# EAGLE schematic Wk5CADpcb2Schematic (EAGLE 9.7.0)
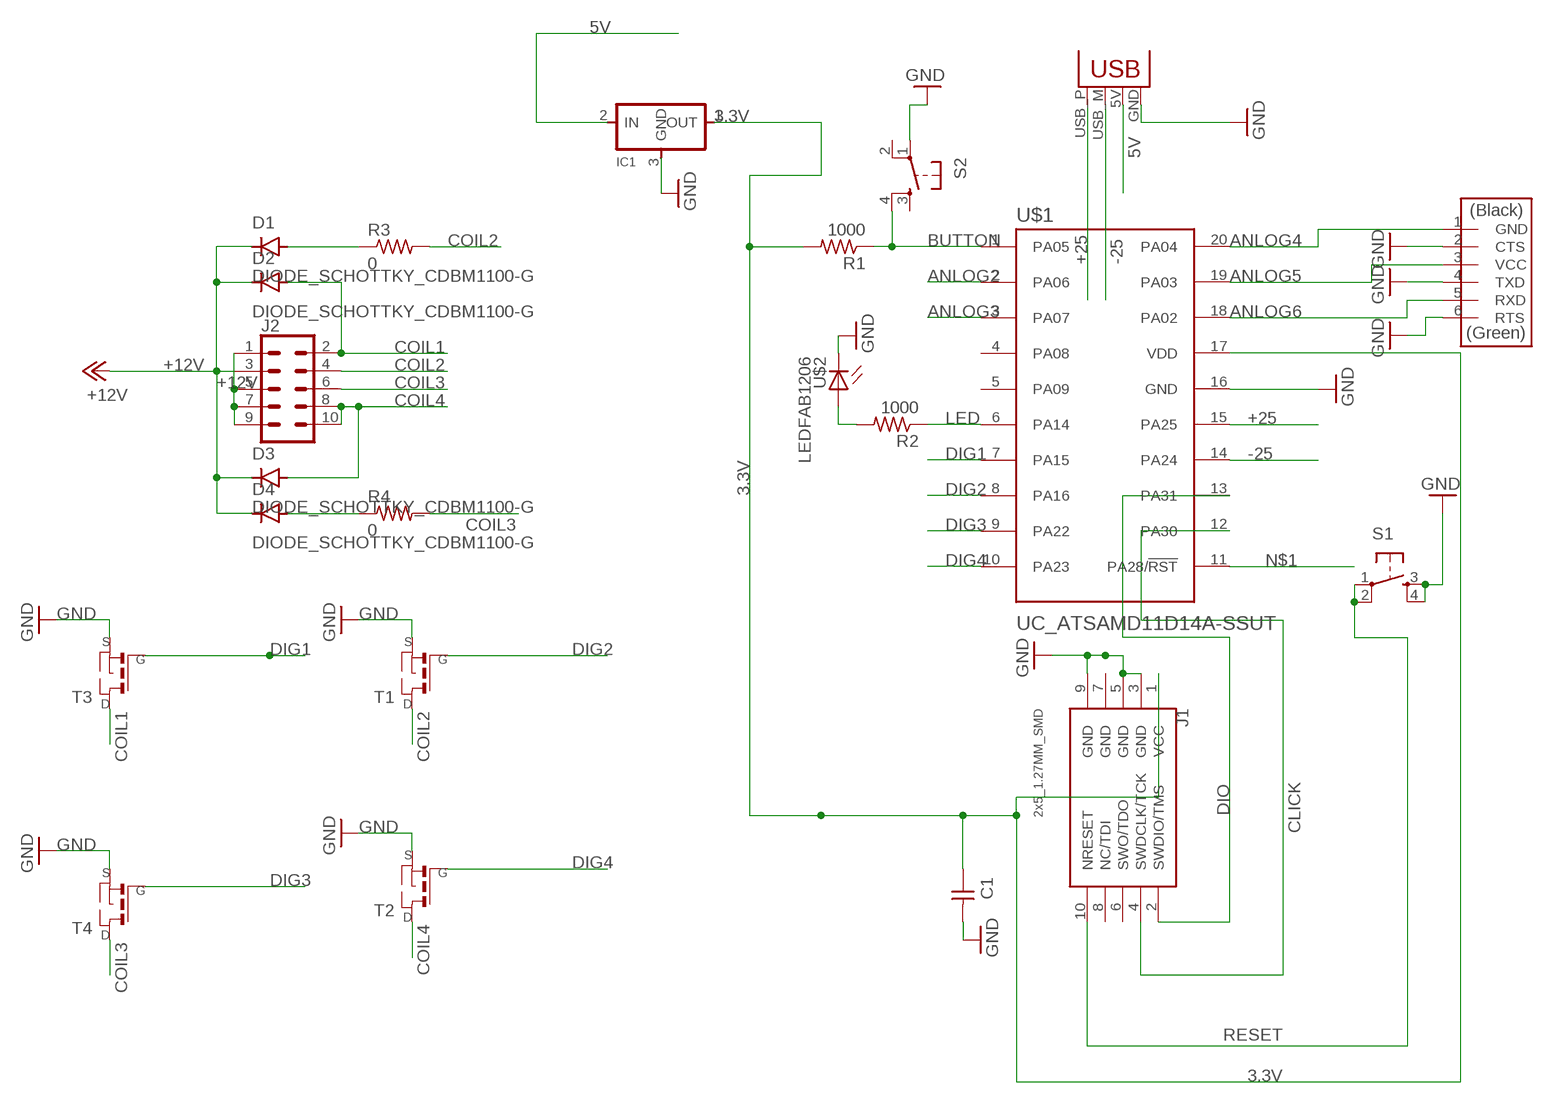
[diagram p0: schematic, sheet 1]

## Parts
C1  CAP_UNPOLARIZEDFAB  [C1206FAB]
D1  DIODE_SCHOTTKY_CDBM1100-G  [MINI-SMA]
D2  DIODE_SCHOTTKY_CDBM1100-G  [MINI-SMA]
D3  DIODE_SCHOTTKY_CDBM1100-G  [MINI-SMA]
D4  DIODE_SCHOTTKY_CDBM1100-G  [MINI-SMA]
IC1  VR_REGULATOR-SOT23SOT23  [SOT23]
J1  CONN_05X2_ARM_DEBUGSMD  [2X5_1.27MM_SMD]
J2  CONN_05X2SHD_SMD  [2X5-SHROUDED_SMD]
R1  1000  R1206FAB  [R1206FAB]
R2  1000  R1206FAB  [R1206FAB]
R3  0  R1206FAB  [R1206FAB]
R4  0  R1206FAB  [R1206FAB]
S1  SW_SWITCH_TACTILE_6MM6MM_SWITCH  [6MM_SWITCH]
S2  SW_SWITCH_TACTILE_6MM6MM_SWITCH  [6MM_SWITCH]
T1  MOSFET_NTO252  [TO252]
T2  MOSFET_NTO252  [TO252]
T3  MOSFET_NTO252  [TO252]
T4  MOSFET_NTO252  [TO252]
U$1  UC_ATSAMD11D14A-SSUT  [SOIC127P1030X265-20N]
U$2  LEDFAB1206  [LED1206FAB]
U$3  CONN_06_FTDI-SMD-HEADER  [1X06SMD]
X1  CONN_USBPCB  [USB-A-PCB]

## Nets
3.3V: C1.1 IC1.1(OUT) J1.1(VCC) R1.2 U$1.17(VDD)
5V: IC1.2(IN) X1.5V(VBUS)
+12V: D1.KATHODE D2.KATHODE D3.KATHODE D4.KATHODE J2.1 J2.3 J2.5 J2.7 J2.9
+25: U$1.15(PA25) X1.USB_P(D+)
-25: U$1.14(PA24) X1.USB_M(D-)
ANLOG2: U$1.2(PA06)
ANLOG3: U$1.3(PA07)
ANLOG4: U$1.20(PA04) U$3.1(GND)
ANLOG5: U$1.19(PA03) U$3.3(VCC)
ANLOG6: U$1.18(PA02) U$3.5(RXD)
BUTTON: R1.1 S2.4(S1) U$1.1(PA05)
CLICK: J1.4(SWDCLK/TCK) U$1.12(PA30)
COIL1: D2.ANODE J2.2 T3.2(D)
COIL2: J2.4 R3.2 T1.2(D)
COIL3: J2.6 R4.2 T4.2(D)
COIL4: D3.ANODE J2.8 J2.10 T2.2(D)
DIG1: T3.1(G) U$1.7(PA15)
DIG2: T1.1(G) U$1.8(PA16)
DIG3: T4.1(G) U$1.9(PA22)
DIG4: T2.1(G) U$1.10(PA23)
DIO: J1.2(SWDIO/TMS) U$1.13(PA31)
GND: C1.2 IC1.3(GND) J1.3(GND) J1.5(GND) J1.9(GND) S1.3(S) S1.4(S1) S2.1(P) T1.3(S) T2.3(S) T3.3(S) T4.3(S) U$1.16(GND) U$2.2(C) U$3.2(CTS) U$3.4(TXD) U$3.6(RTS) X1.GND
LED: R2.1 U$1.6(PA14)
N$1: U$1.11(PA28/!RST)
N$2: R2.2 U$2.1(A)
N$4: D1.ANODE R3.1
N$8: D4.ANODE R4.1
RESET: J1.10(NRESET) S1.1(P) S1.2(P1)
Unconnected: J1.6(SWO/TDO) J1.7(GND) J1.8(NC/TDI) S2.2(P1) S2.3(S) U$1.4(PA08) U$1.5(PA09)

## Library data of the parts
C1 = fab:CAP_UNPOLARIZED
D1-D4 = fab:DIODE_SCHOTTKY_CDBM1100-G: Diode schottky 100V 1A mini-SMA as found in the fablab inventory Reverse Voltage: 100 Volts Forward Current: 1.0 Amp Maximum forward voltage: 0.85 Volts Made by Zaerc.
IC1 = fab:VR_REGULATOR-SOT23
J1 = fab:CONN_05X2_ARM_DEBUG; PACKAGE: 2x5_1.27MM_SMD
J2 = fab:CONN_05X2: Multi connection point. Often used as Generic Header-pin footprint for 0.1 inch spaced/style header connections For AVR SPI programming port, see special device with nice symbol: "AVR_SPI_PROG_5x2.dev" You can populate with any combo of single row headers, but if you'd like an exact match, check these: 2x5 AVR ICSP Male Header <https://www.sparkfun.com/products/778> (PRT-00778) 2x5 Pin Shrouded Header <https://www.sparkfun.com/products/8506> (PRT-08506) On any of the 0.1 inch spaced packages, you can populate with these: Break Away Headers - Straight <https://www.sparkfun.com/products/116> (PRT-00116) Break Away Male Headers - Right Angle <https://www.sparkfun.com/products/553> (PRT-00553) Female Headers <https://www.sparkfun.com/products/115> (PRT-00115) Break Away Headers - Machine Pin <https://www.sparkfun.com/products/117> (PRT-00117) Break Away Female Headers - Swiss Machine Pin <https://www.sparkfun.com/products/743> (PRT-00743) Special note: the shrouded connector mates well with our 5x2 ribbon cables: 2x5 Pin IDC Ribbon Cable <https://www.sparkfun.com/products/8535> (PRT-08535); PROD_ID: CONN-09508
R1-R4 = fab:R: Resistor (US Symbol) Variants with postfix FAB are widened to allow the routing of internal traces
S1 S2 = fab:SW_SWITCH_TACTILE_6MM: OMRON SWITCH
T1-T4 = fab:MOSFET_N: MOS FET
U$1 = fab:UC_ATSAMD11D14A-SSUT
U$2 = fab:LED: LED
U$3 = fab:CONN_06_FTDI-SMD-HEADER
X1 = fab:CONN_USB: USB Connectors USB-B-PTH is fully proven SKU : PRT-00139 USB-miniB is fully proven SKU : PRT-00587 USB-A-PCB is untested. USB-A-H is throughly reviewed, but untested. Spark Fun Electronics SKU : PRT-00437 USB-B-SMT is throughly reviewed, but untested. Needs silkscreen touching up. USB-A-S has not been used/tested USB-MB-H has not been used/tested